# EAGLE design System Power Schematic (EAGLE 9.6.2)
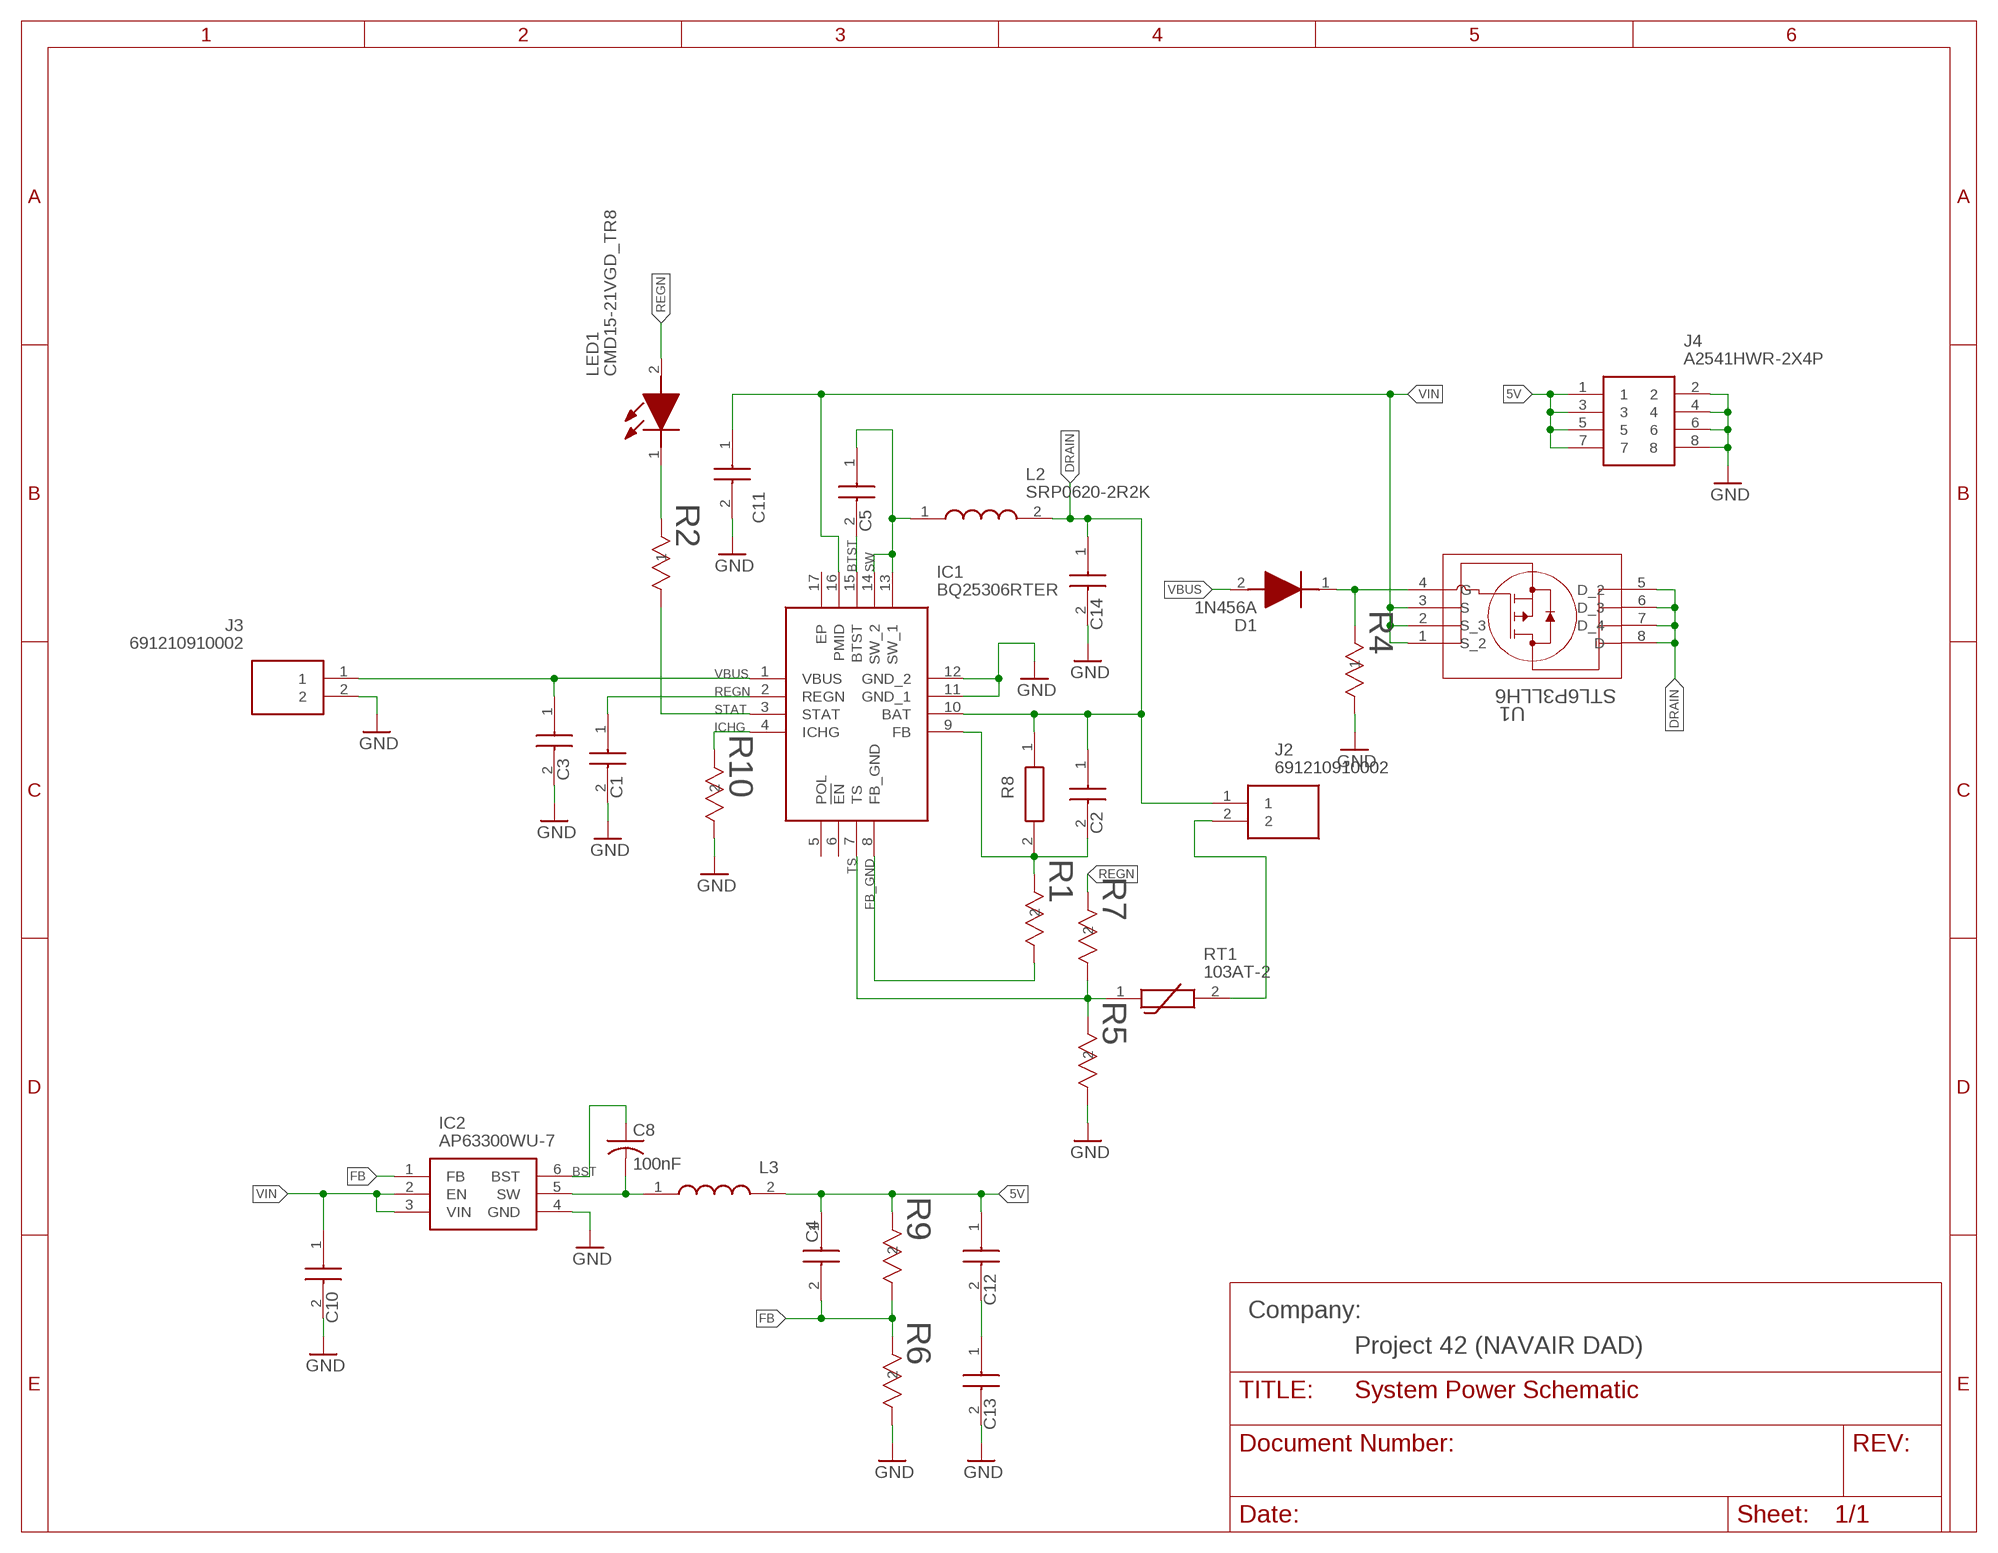
[diagram p0: schematic, sheet 1]

## Parts
C1  TMK107ABJ225KA-T  [CAPC1608X90N]
C2  CGA1A2X7R1H471K030BA  [CAPC1608X90N]
C3  TMK107ABJ225KA-T  [CAPC1608X90N]
C4  CL05C470JB5NNNC  [CAPC1005X55N]
C5  885012107018  [CAPC2012X145N]
C8  100nF  C-USC0805  [C0805]
C10  CL21A106KAYNNNG  [CAPC2012X145N]
C11  CL21A106KAYNNNG  [CAPC2012X145N]
C12  CL31A226KAHNNNE  [CAPC3216X180N]
C13  CL31A226KAHNNNE  [CAPC3216X180N]
C14  CL21A106KAYNNNG  [CAPC2012X145N]
D1  1N456A  [DIO_1N456A]
IC1  BQ25306RTER  [QFN50P300X300X80-17N]
IC2  AP63300WU-7  [SOT95P280X90-6N]
J2  691210910002  [691210910002]
J3  691210910002  [691210910002]
J4  A2541HWR-2X4P  [RHDRRA8W64P254_2X4_1066X850X52]
L2  SRP0620-2R2K  [SRP06202R2K]
L3  SRP0615-6R8K  [SRP06152R2K]
LED1  CMD15-21VGD_TR8  [LEDC3215X130N]
R1  ERA-3AEB204V  [RC0603N_PAN]
R2  RNCP0603FTD1K00  [STA_RNCP0603_STP]
R4  PNM0603E5001BST5  [0603_VIS]
R5  RC0603FR-0712K4L  [RC0603N_YAG]
R6  RC0603FR-0730K1L  [RC0603N_YAG]
R7  RC0603FR-073K48L  [RC0603N_YAG]
R8  RK73H1JTTD1334F  [RESC1608X55N]
R9  RC0603FR-07158KL  [RC0603N_YAG]
R10  RN73C1J13K3BTDF  [RES0603_RN73_TYCO_TYC]
RT1  103AT-2  [103AT2]
U1  STL6P3LLH6  [POWERFLAT_3P3X3P3_STM]

## Nets
5V: C4.1 C12.1 J4.1 J4.3 J4.5 J4.7 L3.2 R9.2
BST: C8.1 IC2.6(BST)
BTST: C5.2 IC1.15(BTST)
DRAIN: C2.1 C14.1 IC1.10(BAT) J2.1 L2.2 R8.1 U1.5(D_2) U1.6(D_3) U1.7(D_4) U1.8(D)
FB: C4.2 IC2.1(FB) R6.2 R9.1
FB_GND: IC1.8(FB_GND) R1.1
GND: C1.2 C3.2 C10.2 C11.2 C13.2 C14.2 IC1.11(GND_1) IC1.12(GND_2) IC2.4(GND) J3.2 J4.2 J4.4 J4.6 J4.8 R4.2 R5.1 R6.1 R10.1
ICHG: IC1.4(ICHG) R10.2
N$1: LED1.1(K) R2.1
N$2: C12.2 C13.1
N$6: D1.1(K) R4.1 U1.4(G)
N$9: J2.2 RT1.2
N$11: C2.2 IC1.9(FB) R1.2 R8.2
N$14: C8.2 IC2.5(SW) L3.1
REGN: C1.1 IC1.2(REGN) LED1.2(A) R7.2
STAT: IC1.3(STAT) R2.2
SW: C5.1 IC1.13(SW_1) IC1.14(SW_2) L2.1
TS: IC1.7(TS) R5.2 R7.1 RT1.1
VBUS: C3.1 D1.2(A) IC1.1(VBUS) J3.1
VIN: C10.1 C11.1 IC1.16(PMID) IC2.2(EN) IC2.3(VIN) U1.1(S_2) U1.2(S_3) U1.3(S)
Unconnected: IC1.5(POL) IC1.6(!EN) IC1.17(EP)

## Notes on the sheet
- Company:
- Project 42 (NAVAIR DAD)

## Library data of the parts
C1 C3 = SamacSys_Parts:TMK107ABJ225KA-T: Taiyo Yuden 0603 (1608M) 2.2uF Multilayer Ceramic Capacitor MLCC 25V dc +/-10% SMD TMK107ABJ225KA-T Source: Datasheet <https://componentsearchengine.com/Datasheets/5/TMK107ABJ225KA-T.pdf>; DESCRIPTION: Taiyo Yuden 0603 (1608M) 2.2uF Multilayer Ceramic Capacitor MLCC 25V dc +/-10% SMD TMK107ABJ225KA-T; HEIGHT: 0.9mm; MANUFACTURER_NAME: TAIYO YUDEN; MANUFACTURER_PART_NUMBER: TMK107ABJ225KA-T; MOUSER_PART_NUMBER: 963-TMK107ABJ225KA-T; MOUSER_PRICE-STOCK: https://www.mouser.co.uk/ProductDetail/Taiyo-Yuden/TMK107ABJ225KA-T?qs=PzICbMaShUcMwZHbdxdUHw%3D%3D
C2 = SamacSys_Parts:CGA1A2X7R1H471K030BA: TDK - CGA1A2X7R1H471K030BA - SMD Multilayer Ceramic Capacitor, 470 pF, 50 V, 0201 [0603 Metric], +/- 10%, X7R, CGA Series Source: Datasheet <https://product.tdk.com/system/files/dam/doc/product/capacitor/ceramic/mlcc/catalog/mlcc_automotive_general_en.pdf>; ARROW_PART_NUMBER: CGA1A2X7R1H471K030BA; ARROW_PRICE-STOCK: https://www.arrow.com/en/products/cga1a2x7r1h471k030ba/tdk?region=europe; DESCRIPTION: TDK - CGA1A2X7R1H471K030BA - SMD Multilayer Ceramic Capacitor, 470 pF, 50 V, 0201 [0603 Metric], +/- 10%, X7R, CGA Series; HEIGHT: 0.9mm; MANUFACTURER_NAME: TDK; MANUFACTURER_PART_NUMBER: CGA1A2X7R1H471K030BA; MOUSER_PART_NUMBER: 810-CGA1A2X7R1H471KA; MOUSER_PRICE-STOCK: https://www.mouser.co.uk/ProductDetail/TDK/CGA1A2X7R1H471K030BA?qs=2FIyTMJ0hNm9jc1ZvmiYZg%3D%3D
C4 = SamacSys_Parts:CL05C470JB5NNNC: Samsung Electro-Mechanics 0402 CL 47pF Ceramic Multilayer Capacitor, 50 V, +125C, C0G Dielectric, +/-5% SMD Source: Datasheet <https://media.digikey.com/pdf/Data Sheets/Samsung PDFs/CL_Series_MLCC_ds.pdf>; ARROW_PART_NUMBER: CL05C470JB5NNNC; ARROW_PRICE-STOCK: https://www.arrow.com/en/products/cl05c470jb5nnnc/samsung-electro-mechanics; DESCRIPTION: Samsung Electro-Mechanics 0402 CL 47pF Ceramic Multilayer Capacitor, 50 V, +125C, C0G Dielectric, +/-5% SMD; HEIGHT: 0.55mm; MANUFACTURER_NAME: SAMSUNG; MANUFACTURER_PART_NUMBER: CL05C470JB5NNNC; MOUSER_PART_NUMBER: 187-CL05C470JB5NNNC; MOUSER_PRICE-STOCK: https://www.mouser.co.uk/ProductDetail/Samsung-Electro-Mechanics/CL05C470JB5NNNC?qs=349EhDEZ59o2dH7U3PWc%252BQ%3D%3D
C5 = SamacSys_Parts:885012107018: Multilayer Ceramic Chip Capacitor WCAP-CSGP Series 0805 4700000pF X5R0805475M025DFCT10000 Source: Datasheet <https://katalog.we-online.com/pbs/datasheet/885012107018.pdf>; DESCRIPTION: Multilayer Ceramic Chip Capacitor WCAP-CSGP Series 0805 4700000pF X5R0805475M025DFCT10000; HEIGHT: 1.45mm; MANUFACTURER_NAME: Wurth Elektronik; MANUFACTURER_PART_NUMBER: 885012107018; MOUSER_PART_NUMBER: 710-885012107018; MOUSER_PRICE-STOCK: https://www.mouser.co.uk/ProductDetail/Wurth-Elektronik/885012107018?qs=0KOYDY2FL29T%252BRJgtTlJUg%3D%3D
C8 = rcl:C-US: CAPACITOR, American symbol; SPICEPREFIX: C
C10 C11 C14 = SamacSys_Parts:CL21A106KAYNNNG: Cap Ceramic 10uF 25V X5R 10% SMD 0805 85C Embossed T/R Source: Datasheet <https://www.arrow.com/en/products/cl21a106kaynnng/samsung-electro-mechanics>; ARROW_PART_NUMBER: CL21A106KAYNNNG; ARROW_PRICE-STOCK: https://www.arrow.com/en/products/cl21a106kaynnng/samsung-electro-mechanics?region=nac; DESCRIPTION: Cap Ceramic 10uF 25V X5R 10% SMD 0805 85C Embossed T/R; HEIGHT: 1.45mm; MANUFACTURER_NAME: SAMSUNG; MANUFACTURER_PART_NUMBER: CL21A106KAYNNNG; MOUSER_PART_NUMBER: 187-CL21A106KAYNNNG; MOUSER_PRICE-STOCK: https://www.mouser.co.uk/ProductDetail/Samsung-Electro-Mechanics/CL21A106KAYNNNG?qs=yOVawPpwOwl2HL%252Buj2PlNg%3D%3D
C12 C13 = SamacSys_Parts:CL31A226KAHNNNE: SAMSUNG ELECTRO-MECHANICS - CL31A226KAHNNNE - CAP, 22UF, 25V, MLCC, 1206 Source: Datasheet <https://datasheet.datasheetarchive.com/originals/distributors/Datasheets_SAMA/9f57e07966b0fde480de744eca033cf5.pdf>; ARROW_PART_NUMBER: CL31A226KAHNNNE; ARROW_PRICE-STOCK: https://www.arrow.com/en/products/cl31a226kahnnne/samsung-electro-mechanics?region=europe; DESCRIPTION: SAMSUNG ELECTRO-MECHANICS - CL31A226KAHNNNE - CAP, 22UF, 25V, MLCC, 1206; HEIGHT: 1.8mm; MANUFACTURER_NAME: SAMSUNG; MANUFACTURER_PART_NUMBER: CL31A226KAHNNNE; MOUSER_PART_NUMBER: 187-CL31A226KAHNNNE; MOUSER_PRICE-STOCK: https://www.mouser.co.uk/ProductDetail/Samsung-Electro-Mechanics/CL31A226KAHNNNE?qs=X6jEic%2FHinCdwsjGJII51w%3D%3D
D1 = SamacSys_Parts:1N456A: Small Signal Diode Source: Datasheet <http://componentsearchengine.com/Datasheets/1/1N456A.pdf>; ARROW_PART_NUMBER: 1N456A; ARROW_PRICE-STOCK: https://www.arrow.com/en/products/1n456a/on-semiconductor; DESCRIPTION: Small Signal Diode; HEIGHT: mm; MANUFACTURER_NAME: onsemi; MANUFACTURER_PART_NUMBER: 1N456A; MOUSER_PART_NUMBER: 512-1N456A; MOUSER_PRICE-STOCK: https://www.mouser.co.uk/ProductDetail/ON-Semiconductor-Fairchild/1N456A?qs=r%2Fl4stf1ffpp6b%2FnRGEMKQ%3D%3D
IC1 = SamacSys_Parts:BQ25306RTER: STANDALONE 17-V, 3-A SINGLE CELL Source: Datasheet <https://datasheet.datasheetarchive.com/originals/distributors/Datasheets_SAMA/2f547f963ca1fcc8a9da6a9d70991dab.pdf>; ARROW_PART_NUMBER: BQ25306RTER; ARROW_PRICE-STOCK: https://www.arrow.com/en/products/bq25306rter/texas-instruments?region=nac; DESCRIPTION: STANDALONE 17-V, 3-A SINGLE CELL; HEIGHT: 0.8mm; MANUFACTURER_NAME: Texas Instruments; MANUFACTURER_PART_NUMBER: BQ25306RTER; MOUSER_PART_NUMBER: 595-BQ25306RTER; MOUSER_PRICE-STOCK: https://www.mouser.co.uk/ProductDetail/Texas-Instruments/BQ25306RTER?qs=81r%252BiQLm7BROlYIxj7RTtQ%3D%3D
IC2 = SamacSys_Parts:AP63300WU-7: DCDC CONV HV BUCK TSOT26 Source: Datasheet <https://www.diodes.com/assets/Datasheets/AP63300-AP63301.pdf>; ARROW_PART_NUMBER: AP63300WU-7; ARROW_PRICE-STOCK: https://www.arrow.com/en/products/ap63300wu-7/diodes-incorporated?region=nac; DESCRIPTION: DCDC CONV HV BUCK TSOT26; HEIGHT: 0.9mm; MANUFACTURER_NAME: Diodes Inc.; MANUFACTURER_PART_NUMBER: AP63300WU-7; MOUSER_PART_NUMBER: 621-AP63300WU-7; MOUSER_PRICE-STOCK: https://www.mouser.co.uk/ProductDetail/Diodes-Incorporated/AP63300WU-7?qs=bZr6mbWTK5nNNXnHDcrFZg%3D%3D
J2 J3 = SamacSys_Parts:691210910002: Wurth Elektronik, 2109 2.54mm Pitch, 2 Way PCB Terminal Block Source: Datasheet <https://www.we-online.de/katalog/datasheet/6912109100xx.pdf>; DESCRIPTION: Wurth Elektronik, 2109 2.54mm Pitch, 2 Way PCB Terminal Block; HEIGHT: 8.7mm; MANUFACTURER_NAME: Wurth Elektronik; MANUFACTURER_PART_NUMBER: 691210910002; MOUSER_PART_NUMBER: 710-691210910002; MOUSER_PRICE-STOCK: https://www.mouser.co.uk/ProductDetail/Wurth-Elektronik/691210910002?qs=sPbYRqrBIVlpmUgpxfjjUA%3D%3D
J4 = SamacSys_Parts:A2541HWR-2X4P: 2 2.54mm 8 Push-Pull Receptacle Through Hole,P=2.54mm Pin Header & Female Header Source: Datasheet <https://datasheet.lcsc.com/lcsc/2010160505_CJT-Changjiang-Connectors-A2541HWR-4P_C225512.pdf>; DESCRIPTION: 2 2.54mm 8 Push-Pull Receptacle Through Hole,P=2.54mm Pin Header & Female Header; HEIGHT: 5.25mm; MANUFACTURER_NAME: CJT(Changjiang Connectors); MANUFACTURER_PART_NUMBER: A2541HWR-2x4P
L2 = SamacSys_Parts:SRP0620-2R2K: Fixed Inductors Ind,7.1x6.7x2mm,2.2uH 10%,8.8A,Shd,SMD Source: Datasheet <https://www.bourns.com/docs/product-datasheets/srp0620.pdf?sfvrsn=40e941f6_4>; ARROW_PART_NUMBER: SRP0620-2R2K; ARROW_PRICE-STOCK: https://www.arrow.com/en/products/srp0620-2r2k/bourns?region=nac; DESCRIPTION: Fixed Inductors Ind,7.1x6.7x2mm,2.2uH 10%,8.8A,Shd,SMD; HEIGHT: 2mm; MANUFACTURER_NAME: Bourns; MANUFACTURER_PART_NUMBER: SRP0620-2R2K; MOUSER_PART_NUMBER: 652-SRP0620-2R2K; MOUSER_PRICE-STOCK: https://www.mouser.co.uk/ProductDetail/Bourns/SRP0620-2R2K?qs=OlC7AqGiEDmHyGnKfrX%2FTg%3D%3D
L3 = SamacSys_Parts:SRP0615-6R8K: Fixed Inductors 6.8 UH 10% Source: Datasheet <https://www.bourns.com/docs/product-datasheets/SRP0615.pdf>; DESCRIPTION: Fixed Inductors 6.8 UH 10%; HEIGHT: 1.5mm; MANUFACTURER_NAME: Bourns; MANUFACTURER_PART_NUMBER: SRP0615-6R8K; MOUSER_PART_NUMBER: 652-SRP0615-6R8K; MOUSER_PRICE-STOCK: https://www.mouser.co.uk/ProductDetail/Bourns/SRP0615-6R8K?qs=OlC7AqGiEDlkcS1ZkzBT2w%3D%3D
LED1 = SamacSys_Parts:CMD15-21VGD_TR8: VCC CMD15-21VGD/TR8, CMD15-21 Series Clear LED, 570 nm,, Rectangle Lens Source: Datasheet <https://componentsearchengine.com/Datasheets/2/CMD15-21VGD_TR8.pdf>; ARROW_PART_NUMBER: CMD15-21VGD/TR8; ARROW_PRICE-STOCK: https://www.arrow.com/en/products/cmd15-21vgdtr8/visual-communications; DESCRIPTION: VCC CMD15-21VGD/TR8, CMD15-21 Series Clear LED, 570 nm,, Rectangle Lens; HEIGHT: 1.3mm; MANUFACTURER_NAME: Visual Communications Company; MANUFACTURER_PART_NUMBER: CMD15-21VGD/TR8; MOUSER_PART_NUMBER: 606-CMD15-21VGD/TR8; MOUSER_PRICE-STOCK: https://www.mouser.co.uk/ProductDetail/VCC/CMD15-21VGD-TR8?qs=rmKzSijf6EYPDoIZjcp6ew%3D%3D
R1 = ERA-3AEB204V:ERA-3AEB204V; COPYRIGHT: Copyright (C) 2023 Ultra Librarian. All rights reserved.; MANUFACTURER_PART_NUMBER: ERA-3AEB204V; MFR_NAME: Panasonic
R2 = RNCP0603FTD1K00:RNCP0603FTD1K00; COPYRIGHT: Copyright (C) 2023 Ultra Librarian. All rights reserved.; MANUFACTURER_PART_NUMBER: RNCP0603FTD1K00; MFR_NAME: Stackpole International
R4 = PNM0603E5001BST5:PNM0603E5001BST5; COPYRIGHT: Copyright (C) 2023 Ultra Librarian. All rights reserved.; MANUFACTURER_PART_NUMBER: PNM0603E5001BST5; MFR_NAME: Vishay
R5 = RC0603FR-0712K4L:RC0603FR-0712K4L; COPYRIGHT: Copyright (C) 2023 Ultra Librarian. All rights reserved.; MANUFACTURER_PART_NUMBER: RC0603FR-0712K4L; MFR_NAME: Yageo
R6 = RC0603FR-0730K1L:RC0603FR-0730K1L; COPYRIGHT: Copyright (C) 2023 Ultra Librarian. All rights reserved.; MANUFACTURER_PART_NUMBER: RC0603FR-0730K1L; MFR_NAME: Yageo
R7 = RC0603FR-073K48L:RC0603FR-073K48L; COPYRIGHT: Copyright (C) 2023 Ultra Librarian. All rights reserved.; MANUFACTURER_PART_NUMBER: RC0603FR-073K48L; MFR_NAME: Yageo
R8 = SamacSys_Parts:RK73H1JTTD1334F: KOA RK73 Resistor Chip 0603 Source: Datasheet <http://www.koaspeer.com/catimages/Products/RK73-RT/RK73-RT.pdf>; ARROW_PART_NUMBER: RK73H1JTTD1334F; ARROW_PRICE-STOCK: https://www.arrow.com/en/products/rk73h1jttd1334f/koa-speer-electronics; DESCRIPTION: KOA RK73 Resistor Chip 0603; HEIGHT: 0.55mm; MANUFACTURER_NAME: KOA Speer; MANUFACTURER_PART_NUMBER: RK73H1JTTD1334F
R9 = RC0603FR-07158KL:RC0603FR-07158KL; COPYRIGHT: Copyright (C) 2023 Ultra Librarian. All rights reserved.; MANUFACTURER_PART_NUMBER: RC0603FR-07158KL; MFR_NAME: Yageo
R10 = RN73C1J13K3BTDF:RN73C1J13K3BTDF; COPYRIGHT: Copyright (C) 2023 Ultra Librarian. All rights reserved.; MANUFACTURER_PART_NUMBER: RN73C1J13K3BTDF; MFR_NAME: TE Connectivity
RT1 = SamacSys_Parts:103AT-2: NTC Thermistors 10kohm 1% Source: Datasheet <https://datasheet.datasheetarchive.com/originals/distributors/Datasheets-30/DSA-588185.pdf>; DESCRIPTION: NTC Thermistors 10kohm 1%; HEIGHT: 8mm; MANUFACTURER_NAME: Semitec; MANUFACTURER_PART_NUMBER: 103AT-2; MOUSER_PART_NUMBER: 954-103AT-2; MOUSER_PRICE-STOCK: https://www.mouser.co.uk/ProductDetail/Semitec/103AT-2?qs=wgO0AD0o1vvcDzsKguD%252Bew%3D%3D
U1 = STL6P3LLH6:STL6P3LLH6; COPYRIGHT: Copyright (C) 2023 Ultra Librarian. All rights reserved.; MANUFACTURER_PART_NUMBER: STL6P3LLH6; MFR_NAME: STMicroelectronics

## Board
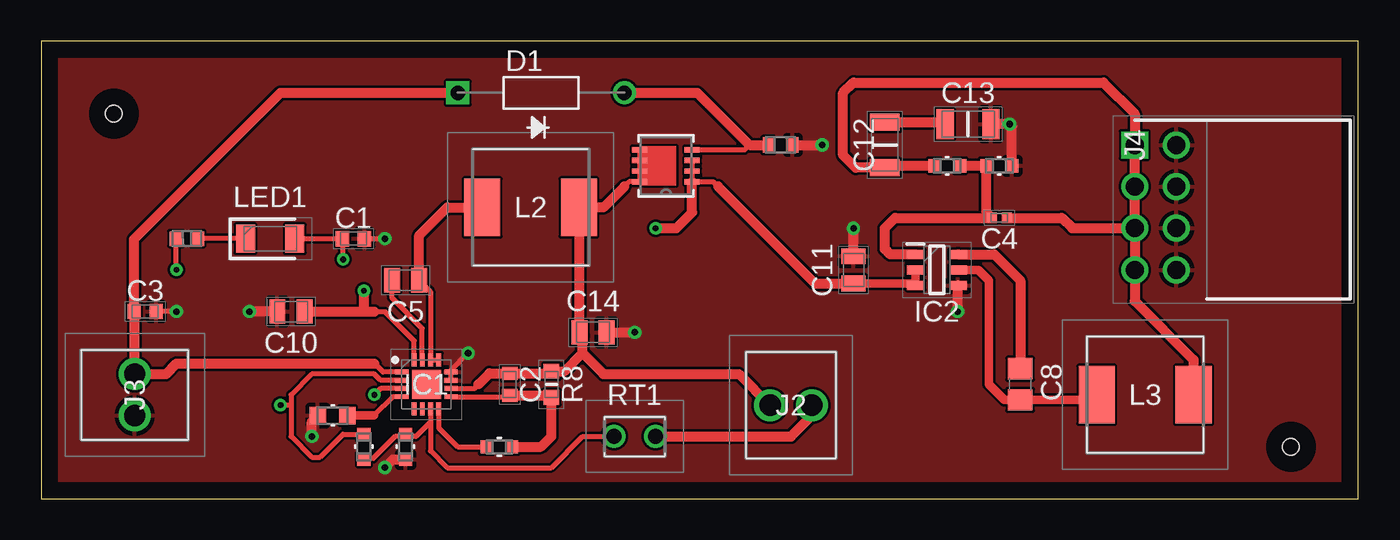
[diagram p1: board, top side]
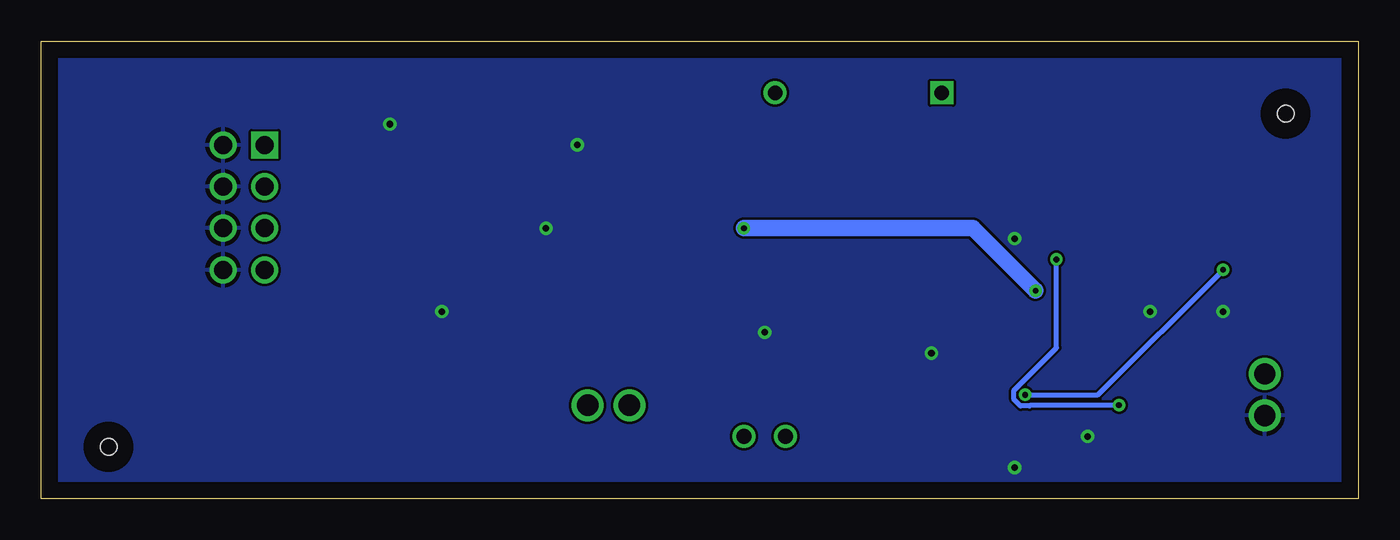
[diagram p2: board, bottom side, seen from below]

Size 80.31 x 27.93 mm. Coordinates in mm from the lower left corner, seen from the top.
Outline: 0,0 80.31,0 80.31,27.93 0,27.93 0,0
Copper layers (1*16): Top 0.035mm / dielectric 1.5mm / Bottom 0.035mm
Design rules "default": minimum track width 6mil, minimum drill 0.35mm, track to track 6mil, track to pad 6mil, pad to pad 6mil, via to via 6mil, smd to smd 6mil, copper to edge 40mil, drill to drill 6mil, minimum pad ring 10mil, minimum via ring 8mil, stop-mask expansion 4mil, vias tented up to drill 0mil, thermal gap 10mil
Holes 1 mm at 4.45,23.5 76.2,3.17

### Footprints (pad centres in the part's own frame; a part is rotated, then mirrored left to right if it is on the bottom)
CAPC1608X90N = smd 0.81 x 0.94: 1 -0.67,0; 2 0.67,0
CAPC1005X55N = smd 0.6 x 0.62: 1 -0.46,0; 2 0.46,0
CAPC2012X145N = smd 0.97 x 1.47: 1 -0.83,0; 2 0.83,0
C0805 = smd 1.3 x 1.5: 1 -0.95,0; 2 0.95,0
CAPC3216X180N = smd 1.05 x 1.82: 1 -1.39,0; 2 1.39,0
DIO_1N456A = drill 0.889 pad 1.333: 1 -10.16,0 | drill 0.889 pad 1.333 square: 2 0,0
QFN50P300X300X80-17N = smd 0.8 x 0.3: 1 -1.5,0.75; 2 -1.5,0.25; 3 -1.5,-0.25; 4 -1.5,-0.75; 9 1.5,-0.75; 10 1.5,-0.25; 11 1.5,0.25; 12 1.5,0.75 | smd 0.3 x 0.8: 5 -0.75,-1.5; 6 -0.25,-1.5; 7 0.25,-1.5; 8 0.75,-1.5; 13 0.75,1.5; 14 0.25,1.5; 15 -0.25,1.5; 16 -0.75,1.5 | smd 1.76 x 1.76: 17 0,0
SOT95P280X90-6N = smd 1.05 x 0.55: 1 -1.3,0.95; 2 -1.3,0; 3 -1.3,-0.95; 4 1.3,-0.95; 5 1.3,0; 6 1.3,0.95
691210910002 = drill 1.3 pad 1.95: 1 0,0; 2 2.54,0
RHDRRA8W64P254_2X4_1066X850X52 = drill 1.1 pad 1.65 square: 1 0,0 | drill 1.1 pad 1.65: 2 0,2.54; 3 2.54,0; 4 2.54,2.54; 5 5.08,0; 6 5.08,2.54; 7 7.62,0; 8 7.62,2.54
SRP06202R2K = smd 2.2 x 3.5: 1 -2.95,0; 2 2.95,0
SRP06152R2K = smd 2.2 x 3.5: 1 -2.95,0; 2 2.95,0
LEDC3215X130N = smd 1.15 x 1.7: 1 -1.5,0; 2 1.5,0
RC0603N_PAN = smd 0.756 x 0.8: 1 -0.778,0; 2 0.778,0
STA_RNCP0603_STP = smd 0.813 x 0.889: 1 -0.648,0; 2 0.648,0
0603_VIS = smd 0.703 x 0.95: 1 -0.737,0; 2 0.737,0
RC0603N_YAG = smd 0.762 x 0.813: 1 -0.775,0; 2 0.775,0
RESC1608X55N = smd 0.9 x 0.95: 1 -0.8,0; 2 0.8,0
RES0603_RN73_TYCO_TYC = smd 0.991 x 1.092: 1 -0.902,0; 2 0.902,0
103AT2 = drill 0.9 pad 1.4: 1 -1.27,0; 2 1.27,0
POWERFLAT_3P3X3P3_STM = smd 0.914 x 0.33: 1 -1.6,0.975; 2 -1.6,0.325; 3 -1.6,-0.325; 4 -1.6,-0.975; 5 1.6,-0.975; 6 1.6,-0.325; 7 1.6,0.325; 8 1.6,0.975

### Placement (x,y rotation side)
C1  19.05,15.88 0 top
C2  28.57,6.99 270 top
C3  6.35,11.43 0 top
C4  58.42,17.14 180 top
C5  22.23,13.34 180 top
C8  59.69,6.99 270 top
C10  15.24,11.43 180 top
C11  49.53,13.97 90 top
C12  51.44,21.59 90 top
C13  56.52,22.86 0 top
C14  33.66,10.16 0 top
D1  25.4,24.77 180 top
IC1  23.5,6.99 0 top
IC2  54.61,13.97 0 top
J2  44.45,5.71 0 top
J3  5.71,7.62 270 top
J4  66.67,21.59 270 top
L2  29.84,17.78 0 top
L3  67.31,6.35 0 top
LED1  13.97,15.88 0 top
R1  27.94,3.17 0 top
R2  8.89,15.88 180 top
R4  45.09,21.59 0 top
R5  22.23,3.17 90 top
R6  58.42,20.32 180 top
R7  19.68,3.17 90 top
R8  31.11,6.99 270 top
R9  55.24,20.32 180 top
R10  17.78,5.08 0 top
RT1  36.2,3.81 0 top
U1  38.1,20.32 180 top

### Tracks (layer width: path | path; a pad name or v marks a point on that pad's centre or on a via)
5V
  Top 0.61: R9.2 51.55,20.32 C12.1 49.65,20.2 48.9,20.95 48.9,24.77 49.53,25.4 64.77,25.4 66.67,23.5 J4.1 J4.3 J4.5 | C4.1 62.23,17.14 62.87,16.51 J4.5 | J4.5 J4.7 66.67,12.06 70.26,8.48 L3.2
BST
  Top 0.61: IC2.6 58.1,14.92 59.69,13.34 C8.1
BTST
  Top 0.305: IC1.15 23.25,10.41 21.39,12.26 C5.2
DRAIN
  Top 0.305: U1.5 U1.6 U1.7 U1.8 35.85,19.34 35.56,19.05 | IC1.10 26.42,6.74 26.67,6.99
  Top 0.61: 35.56,19.05 34.29,17.78 L2.2 32.83,17.75 C14.1 33.02,9.96 33.02,8.89 | 26.67,6.99 27.34,7.66 C2.1 30.98,7.66 R8.1 31.91,7.79 33.02,8.89 | 33.02,8.89 34.29,7.62 42.55,7.62 J2.1
FB
  Top 0.61: R9.1 R6.2 57.65,17.46 C4.2 52.07,17.14 51.44,16.51 51.44,15.24 51.76,14.92 IC2.1
FB_GND
  Top 0.305: IC1.8 24.25,4.33 25.4,3.17 R1.1
GND  (via drill 0.4)
  Top 0.305: IC1.11 IC1.12 25,7.85 v26.04,8.89 | v8.26,11.43 C3.2 | C1.2 v20.95,15.88
  Top 0.61: C14.2 v36.2,10.16 | R4.2 v47.62,21.59 | C11.2 v49.53,16.51 | v55.88,11.43 55.88,12.99 IC2.4 | R6.1 59.2,22.72 v59.05,22.86 C13.2 | C10.2 v12.7,11.43 | v16.51,3.81 16.51,4.71 R10.1 | v20.95,1.91 21.45,2.4 R5.1
  pour Bottom: -1.27,-0.64 -1.27,29.21 81.28,29.21 81.28,-1.27 -0.64,-1.27
  pour Top: 0,0 0,27.94 80.64,27.94 80.64,0
ICHG
  Top 0.305: IC1.4 21.48,6.24 20.32,5.08
  Top 0.508: 20.32,5.08 R10.2
N$1
  Top 0.305: LED1.1 R2.1
N$2
  Top 0.61: C12.2 55.01,22.98 C13.1
N$6
  Top 0.305: U1.4 42.88,21.3 43.18,21.59
  Top 0.61: D1.1 40.01,24.77 43.18,21.59 R4.1
N$9
  Top 0.61: RT1.2 45.72,3.81 46.99,5.08 J2.2
N$11
  Top 0.305: IC1.9 28.5,6.24 C2.2
  Top 0.61: R1.2 30.48,3.17 31.11,3.81 R8.2 30.98,6.32 C2.2
N$14
  Top 0.508: IC2.5 57.15,13.97 57.78,13.34 57.78,6.99 58.73,6.04 C8.2 64.05,6.04 L3.1
REGN  (via drill 0.35)
  Top 0.305: IC1.2 20.7,7.24 20.32,7.62 16.51,7.62 15.24,6.35 15.24,5.71 | R7.2 18.41,3.95 17,2.54 16.51,2.54 15.24,3.81 15.24,5.71 | 15.24,5.71 v14.61,5.71 | v18.41,14.61 18.41,15.84 C1.1 LED1.2
  Bottom 0.305: v14.61,5.71 19.99,5.71 20.04,5.67 20.6,5.67 21,6.07 21,6.63 18.41,9.22 v18.41,14.61
STAT  (via drill 0.35)
  Top 0.305: IC1.3 20.7,6.74 v20.32,6.35 | v8.26,13.97 8.24,13.98 R2.2
  Bottom 0.305: v20.32,6.35 15.88,6.35 v8.26,13.97
SW
  Top 0.305: C5.1 23.75,12.64 IC1.14 IC1.13
  Top 0.61: C5.1 23.05,16.07 24.77,17.78 L2.1
TS
  Top 0.305: R7.1 19.75,2.47 20.25,2.47 21.59,3.81 22.09,3.81 R5.2 22.36,3.81 22.86,3.81 23.75,4.7 | IC1.7 23.75,4.7 | 23.75,4.7 23.75,2.92 24.77,1.91 31.11,1.91 33.02,3.81 RT1.1
VBUS
  Top 0.305: IC1.1 20.85,7.74 20.51,8.08 20.5,8.08 20.32,8.26
  Top 0.61: D1.2 14.61,24.77 5.68,15.84 C3.1 5.68,7.66 J3.1 7.62,7.62 8.26,8.26 20.32,8.26
VIN  (via drill 0.35)
  Top 0.305: IC1.16 22.75,9.64 20.95,11.43 20.32,11.43 | U1.3 U1.2 U1.1 40.98,19.34 41.27,19.05
  Top 0.508: C11.1 53.19,13.14 IC2.3 IC2.2
  Top 0.61: C10.1 19.68,11.43 | 19.68,11.43 20.32,11.43 | 41.27,19.05 47.19,13.14 C11.1 | 19.68,11.43 v19.68,12.7 | v37.47,16.51 38.73,16.51 39.7,17.48 U1.1
  Bottom 1.016: v19.68,12.7 23.5,16.51 v37.47,16.51